# Altium schematic sheet Output_Relay.SchDoc: OUTPUT_RELAY
size A4
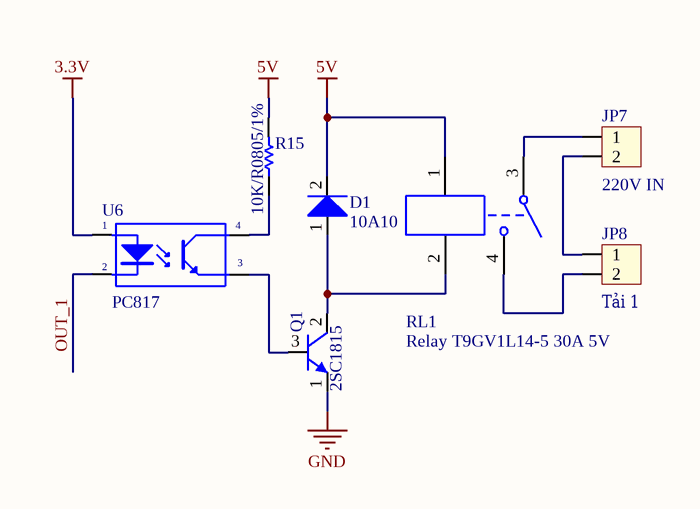
[diagram p0: Output_Relay.SchDoc]

## Parts
D1  10A10  [10A10]
JP7  220V IN  [DOMINO_OSTTC_2P]
JP8  Tải 1  [DOMINO_OSTTC_2P]
Q1  2SC1815  [2SC1815]
R15  10K/R0805/1%  [Res 0805 SMD]
RL1  Relay T9GV1L14-5 30A 5V  [Relay T9GV1L14-5 30A 5V]
U6  PC817  [PC817]

## Nets
3.3V: U6.1(A)
5V: D1.2(K) R15.2 RL1.1
GND: Q1.1(E)
OUT_1: U6.2(K)
NetD1_1: D1.1(A) Q1.2(C) RL1.2
NetJP7_1: JP7.1 RL1.3
NetJP7_2: JP7.2 JP8.1
NetJP8_2: JP8.2 RL1.4
NetQ1_3: Q1.3(B) U6.3(E)
NetR15_1: R15.1 U6.4(C)

## Notes on the sheet
- Title
- Size:
- Date:
- A4
- Number:
- Time:
- Revision:
- Sheet
- of
- File:

## Library data of the parts
D1 = 10A10: Diode LS 10A 1000V DO-201EX; ComponentLink1Description: Datasheet; ComponentLink1URL: D:\Dropbox\Datasheets\Diodes and Rectifiers\Diodes\10AXX.pdf; Unit Price: 0.1429
JP7 JP8 = Con2: Connector 2; Value: Connector 2
Q1 = 2SC1815: Trans NPN 50V 150mA TO-92; ComponentLink1Description: Datasheet; ComponentLink1URL: D:\Dropbox\Datasheets\Transistors\P Channel Bipolar\2SC1815.pdf; Unit Price: 0.0143
R15 = 249K/R0805/1%: RES SMD 249K OHM 1% 1/10W 0805; Manufacturer: Yageo; Manufacturer Part Number: RC0603FR-07249KL; Power (Watts): 0.1W, 1/10W; Temperature Coefficient: ±100ppm/°C; Supplier 1: Digi-Key; RoHS: RoHS Compliant; Category: Resistors; Stock 1: 370515; Pricing 1: 1=0.1, 10=0.015, 100=0.006, 1000=0.00268, 2500=0.00233 (USD); Packaging: Cut Tape (CT); Part Status: Active; Tolerance: ±1%; Composition: Thick Film; Features: Moisture Resistant; Operating Temperature: -55°C ~ 155°C; Package / Case: 0603 (1608 Metric); Supplier Device Package: 0603; Size / Dimension: 0.063" L x 0.032" W (1.60mm x 0.80mm); Height - Seated (Max): 0.022" (0.55mm); Failure Rate: -; ComponentLink1URL: http://www.yageo.com/documents/recent/PYu-RC_Group_51_RoHS_L_8.pdf; ComponentLink1Description: http://www.yageo.com/documents/recent/PYu-RC_Group_51_RoHS_L_8.pdf
RL1 = Relay T9GV1L14-5 30A 5V: Single-Pole Dual-Throw Relay; Published: 24-Mar-1999; LatestRevisionDate: 17-Jul-2002; LatestRevisionNote: Re-released for DXP Platform.; PackageReference: MODULE5B; Publisher: Altium Limited
U6 = PC817: Single Opto; Value: PC817